# EAGLE design Laser_Teensy_No_AudShield_bckup (EAGLE 9.6.2)

## Sheet 1 of 3
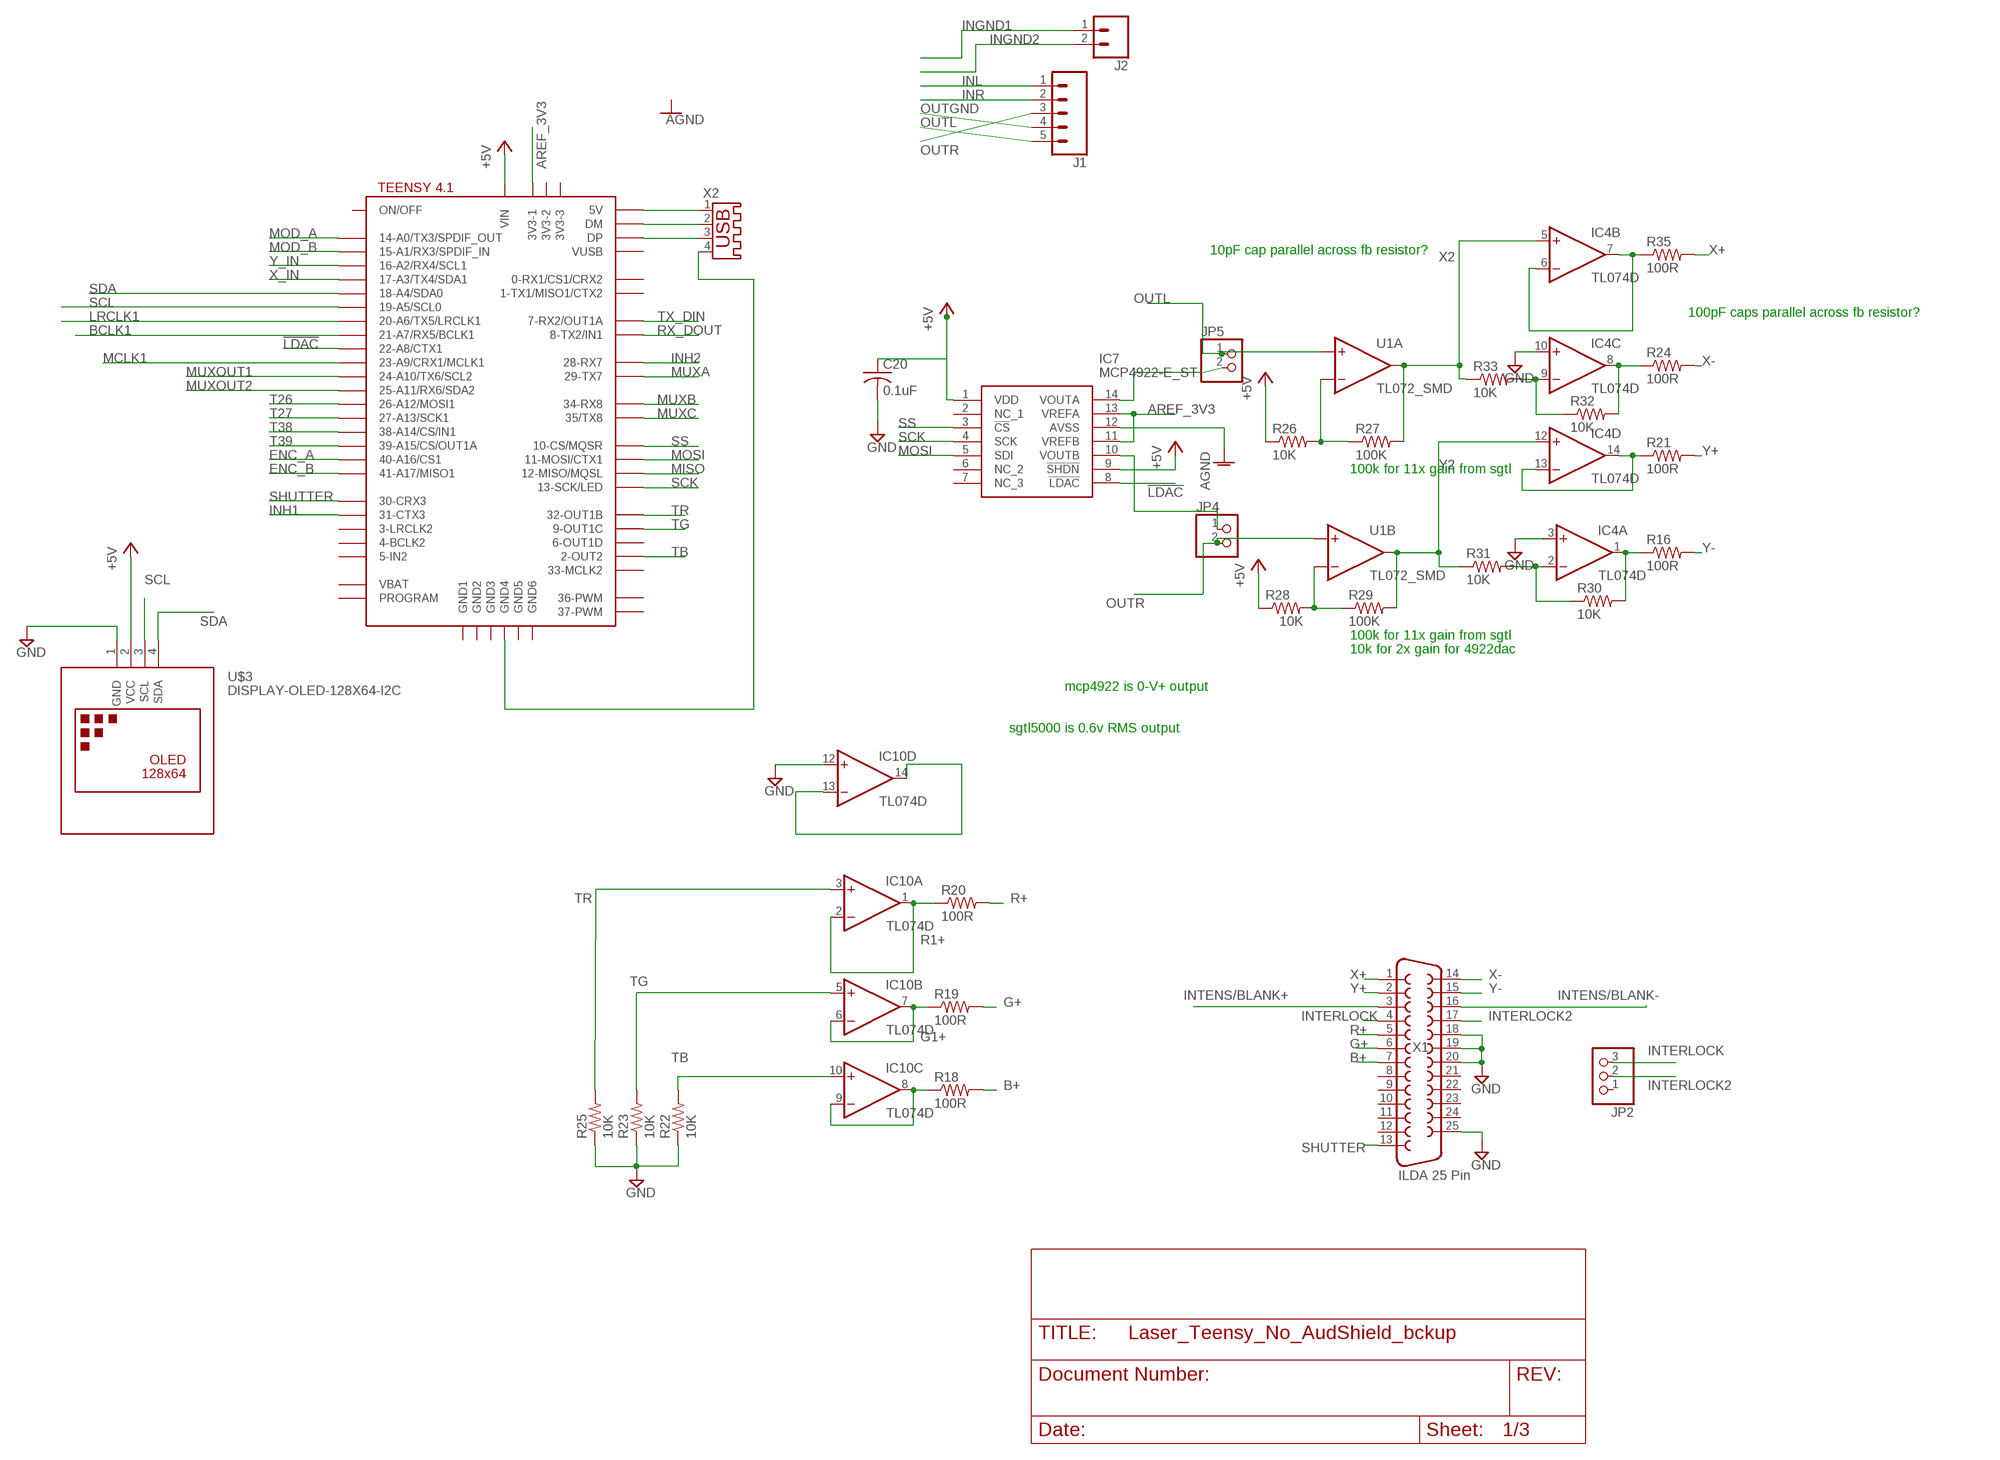
[diagram p0: schematic, sheet 1]

### Parts
C20  0.1uF  C-USC0603  [C0603]
IC4  TL074D  [SO14]
IC7  MCP4922-E_ST  [SOP65P638X110-14N]
IC10  TL074D  [SO14]
J1  CONN_05  [1X05]
J2  CONN_02  [1X02]
JP2  PINHD-1X3  [1X03]
JP4  PINHD-1X2  [1X02]
JP5  PINHD-1X2  [1X02]
R16  100R  R-US_0204/5  [0204/5]
R18  100R  R-US_0204/5  [0204/5]
R19  100R  R-US_0204/5  [0204/5]
R20  100R  R-US_0204/5  [0204/5]
R21  100R  R-US_0204/5  [0204/5]
R22  10K  R-US_0204/5  [0204/5]
R23  10K  R-US_0204/5  [0204/5]
R24  100R  R-US_0204/5  [0204/5]
R25  10K  R-US_0204/5  [0204/5]
R26  10K  R-US_0204/5  [0204/5]
R27  100K  R-US_0204/5  [0204/5]
R28  10K  R-US_0204/5  [0204/5]
R29  100K  R-US_0204/5  [0204/5]
R30  10K  R-US_0204/5  [0204/5]
R31  10K  R-US_0204/5  [0204/5]
R32  10K  R-US_R0603  [R0603]
R33  10K  R-US_0204/5  [0204/5]
R35  100R  R-US_0204/5  [0204/5]
U1  TL072_SMD  [SO08]
U$2  TEENSY41-E  [TENNSY41-E]
U$3  DISPLAY-OLED-128X64-I2C  [DISPLAY-OLED-128X64-I2C]
X1  ILDA 25 Pin  F25D  [F25D]
X2  USB-A003  [USB-A003]

### Nets
!LDAC: IC7.8(!LDAC) U$2.22-A8/CTX1
+5V [power]: C20.1 IC7.1(VDD) IC7.9(!SHDN) R26.1 R28.1 U$2.VIN U$3.2(VCC) ; also sheet 2,3
AGND: IC7.12(AVSS)
AREF_3V3: IC7.11(VREFB) IC7.13(VREFA) U$2.3V3-1
B1+1: IC10.8(C:OUT) IC10.9(C:-IN) R18.1
B+: R18.2 X1.7
BCLK1: U$2.21-A7/RX5/BCLK1
ENC_A: U$2.40-A16/CS1 ; also sheet 2
ENC_B: U$2.41-A17/MISO1 ; also sheet 2
G1+: IC10.6(B:-IN) IC10.7(B:OUT) R19.1
G+: R19.2 X1.6
GND: C20.2 IC4.3(A:+IN) IC4.10(C:+IN) IC10.12(D:+IN) R22.1 R23.1 R25.1 U$3.1(GND) X1.18 X1.19 X1.20 X1.25 ; also sheet 2,3
INGND1: J2.1
INGND2: J2.2
INH1: U$2.31-CTX3 ; also sheet 2
INH2: U$2.28-RX7 ; also sheet 2
INL: J1.1
INR: J1.2
INTENS/BLANK+: X1.3
INTENS/BLANK-: X1.16
INTERLOCK: JP2.3 X1.4
INTERLOCK2: JP2.2 X1.17
LRCLK1: U$2.20-A6/TX5/LRCLK1
MCLK1: U$2.23-A9/CRX1/MCLK1
MISO: U$2.12-MISO/MQSL
MOD_A: U$2.14-A0/TX3/SPDIF_OUT ; also sheet 2
MOD_B: U$2.15-A1/RX3/SPDIF_IN ; also sheet 2
MOSI: IC7.5(SDI) U$2.11-MOSI/CTX1
MUXA: U$2.29-TX7 ; also sheet 2
MUXB: U$2.34-RX8 ; also sheet 2
MUXC: U$2.35-TX8(35/TX8) ; also sheet 2
MUXOUT1: U$2.24-A10/TX6/SCL2 ; also sheet 2
MUXOUT2: U$2.25-A11/RX6/SDA2 ; also sheet 2
N$1: IC7.14(VOUTA) JP5.2
N$3: U$2.+5V(5V) X2.1
N$4: U$2.DM X2.2
N$5: U$2.DP X2.3
N$12: U$2.GND4 X2.4
N$13: IC10.13(D:-IN) IC10.14(D:OUT)
N$17: IC7.10(VOUTB) JP4.1
N$30: R26.2 R27.1 U1.2(A:-IN)
N$31: R28.2 R29.1 U1.6(B:-IN)
N$35: IC4.9(C:-IN) R32.1 R33.2
N$36: IC4.2(A:-IN) R30.1 R31.2
OUTGND: J1.4
OUTL: J1.5 JP5.1 U1.3(A:+IN)
OUTR: J1.3 JP4.2 U1.5(B:+IN)
R1+: IC10.1(A:OUT) IC10.2(A:-IN) R20.1
R+: R20.2 X1.5
RX_DOUT: U$2.8-TX2/IN1
SCK: IC7.4(SCK) U$2.13-SCK/LED
SCL: U$2.19-A5/SCL0 U$3.3(SCL)
SDA: U$2.18-A4/SDA0 U$3.4(SDA)
SHUTTER: U$2.30-CRX3 X1.13
SS: IC7.3(!CS) U$2.10-CS\MQSR(10-CS/MQSR)
T26: U$2.26-A12/MOSI1 ; also sheet 2
T27: U$2.27-A13/SCK1 ; also sheet 2
T38: U$2.38-A14/CS/IN1 ; also sheet 2
T39: U$2.39-A15/CS/OUT1A
TB: IC10.10(C:+IN) R22.2 U$2.2-OUT2
TG: IC10.5(B:+IN) R23.2 U$2.9-OUT1C
TR: IC10.3(A:+IN) R25.2 U$2.32-OUT1B
TX_DIN: U$2.7-RX2/OUT1A
X1+: IC4.6(B:-IN) IC4.7(B:OUT) R35.1
X1-: IC4.8(C:OUT) R24.1 R32.2
X2: IC4.5(B:+IN) R27.2 R33.1 U1.1(A:OUT)
X+: R35.2 X1.1
X-: R24.2 X1.14
X_IN: U$2.17-A3/TX4/SDA1 ; also sheet 2
Y1+: IC4.13(D:-IN) IC4.14(D:OUT) R21.1
Y1-: IC4.1(A:OUT) R16.1 R30.2
Y2: IC4.12(D:+IN) R29.2 R31.1 U1.7(B:OUT)
Y+: R21.2 X1.2
Y-: R16.2 X1.15
Y_IN: U$2.16-A2/RX4/SCL1 ; also sheet 2
Unconnected: IC7.2(NC_1) IC7.6(NC_2) IC7.7(NC_3) JP2.1 U$2.0-RX1/CS1/CRX2 U$2.1-TX1/MISO1/CTX2 U$2.3-LRCLK2 U$2.3V3-2 U$2.3V3-3 U$2.4-BCLK2 U$2.5-IN2 U$2.6-OUT1D U$2.33-MCLK2 U$2.36-PWM U$2.37-PWM U$2.GND1 U$2.GND2 U$2.GND3 U$2.GND5 U$2.GND6 U$2.ON/OFF U$2.PROGRAM U$2.VBAT U$2.VUSB X1.8 X1.9 X1.10 X1.11 X1.12 X1.21 X1.22 X1.23 X1.24

### Notes on the sheet
- 10pF cap parallel across fb resistor?
- 100pF caps parallel across fb resistor?
- 100k for 11x gain from sgtl
- 100k for 11x gain from sgtl
- 10k for 2x gain for 4922dac
- mcp4922 is 0-V+ output
- sgtl5000 is 0.6v RMS output

## Sheet 2 of 3
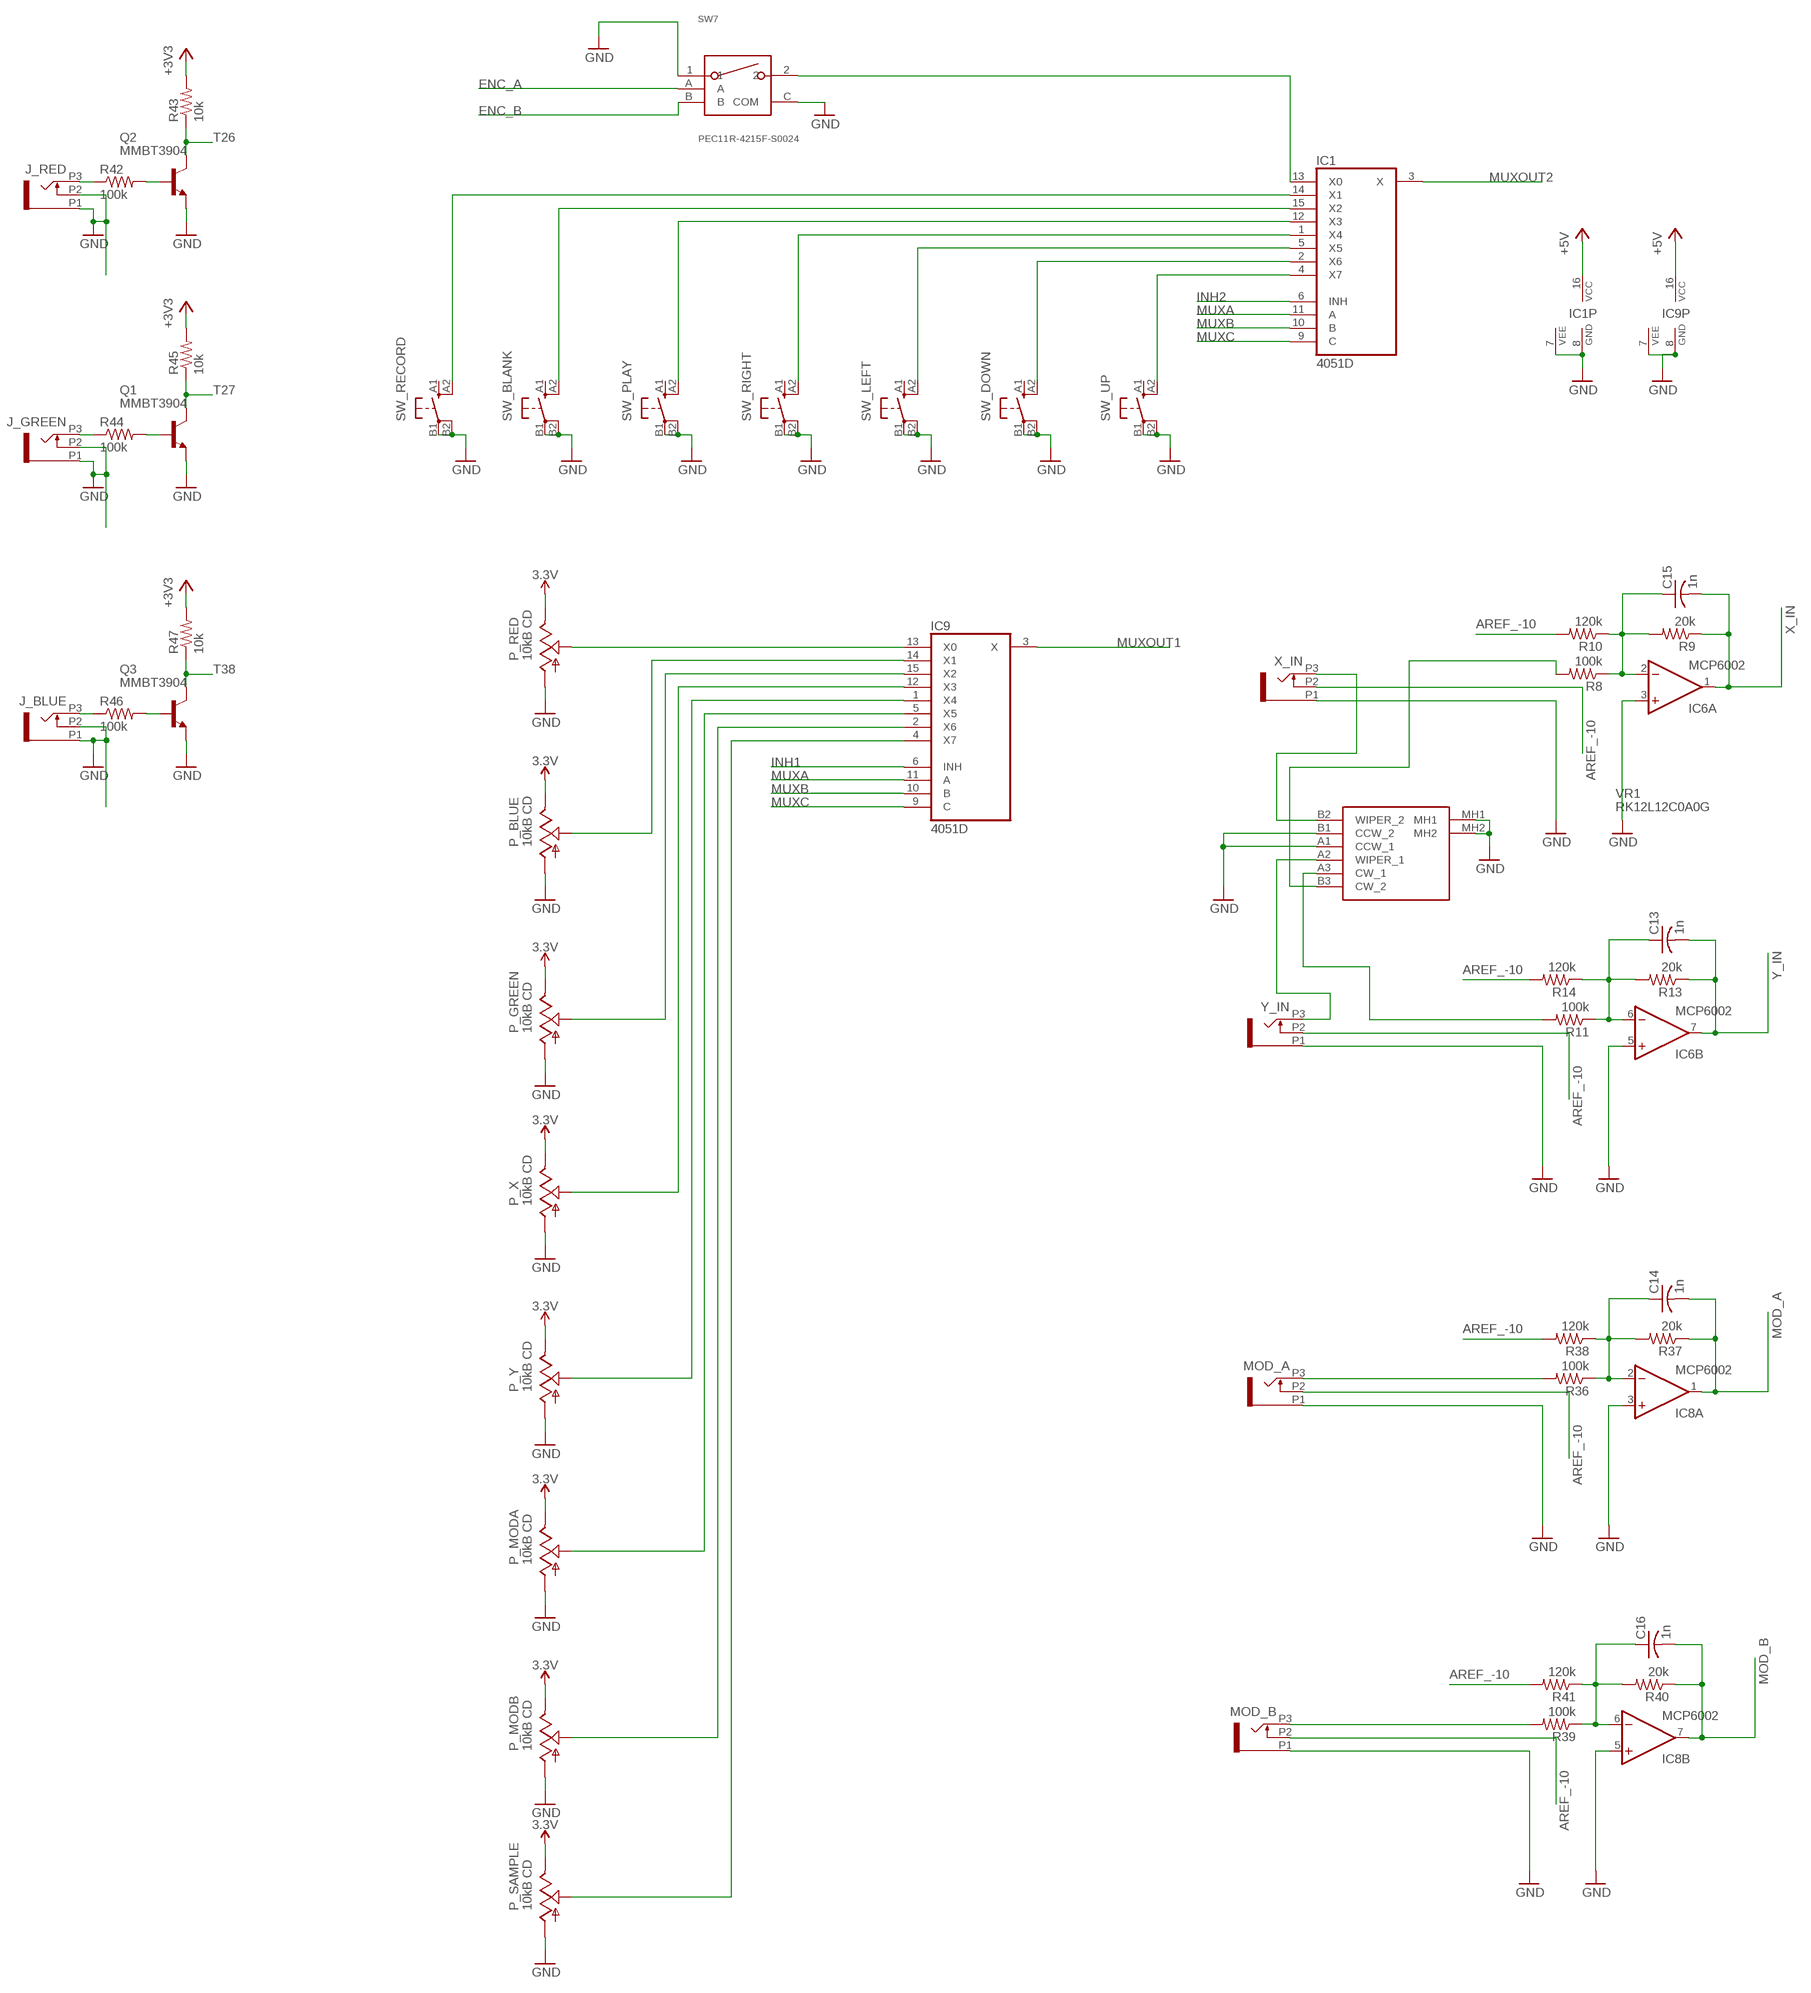
[diagram p1: schematic, sheet 2]

### Parts
C13  1n  C-US050-025X075  [C050-025X075]
C14  1n  C-US050-025X075  [C050-025X075]
C15  1n  C-US050-025X075  [C050-025X075]
C16  1n  C-US050-025X075  [C050-025X075]
IC1  4051D  [SO16]
IC6  MCP6002  TL072D  [SO08]
IC8  MCP6002  TL072D  [SO08]
IC9  4051D  [SO16]
J_BLUE  PJ301_THONKICONN6  [WQP_PJ_301M6]
J_GREEN  PJ301_THONKICONN6  [WQP_PJ_301M6]
J_RED  PJ301_THONKICONN6  [WQP_PJ_301M6]
MOD_A  PJ301_THONKICONN6  [WQP_PJ_301M6]
MOD_B  PJ301_THONKICONN6  [WQP_PJ_301M6]
P_BLUE  10kB CD  POT_USVERTICAL_PS  [ALPS_POT_VERTICAL_PS]
P_GREEN  10kB CD  POT_USVERTICAL_PS  [ALPS_POT_VERTICAL_PS]
P_MODA  10kB CD  POT_USVERTICAL_PS  [ALPS_POT_VERTICAL_PS]
P_MODB  10kB CD  POT_USVERTICAL_PS  [ALPS_POT_VERTICAL_PS]
P_RED  10kB CD  POT_USVERTICAL_PS  [ALPS_POT_VERTICAL_PS]
P_SAMPLE  10kB CD  POT_USVERTICAL_PS  [ALPS_POT_VERTICAL_PS]
P_X  10kB CD  POT_USVERTICAL_PS  [ALPS_POT_VERTICAL_PS]
P_Y  10kB CD  POT_USVERTICAL_PS  [ALPS_POT_VERTICAL_PS]
Q1  MMBT3904  MMBT3904LT1-NPN-SOT23-BEC  [SOT23-BEC]
Q2  MMBT3904  MMBT3904LT1-NPN-SOT23-BEC  [SOT23-BEC]
Q3  MMBT3904  MMBT3904LT1-NPN-SOT23-BEC  [SOT23-BEC]
R8  100k  R-US_0204/5  [0204/5]
R9  20k  R-US_0204/5  [0204/5]
R10  120k  R-US_0204/5  [0204/5]
R11  100k  R-US_0204/5  [0204/5]
R13  20k  R-US_0204/5  [0204/5]
R14  120k  R-US_0204/5  [0204/5]
R36  100k  R-US_0204/5  [0204/5]
R37  20k  R-US_0204/5  [0204/5]
R38  120k  R-US_0204/5  [0204/5]
R39  100k  R-US_0204/5  [0204/5]
R40  20k  R-US_0204/5  [0204/5]
R41  120k  R-US_0204/5  [0204/5]
R42  100k  R-US_0204/5  [0204/5]
R43  10k  R-US_0204/5  [0204/5]
R44  100k  R-US_0204/5  [0204/5]
R45  10k  R-US_0204/5  [0204/5]
R46  100k  R-US_0204/5  [0204/5]
R47  10k  R-US_0204/5  [0204/5]
SW7  PEC11R-4215F-S0024  [PEC11R-4215F-S0024]
SW_BLANK  D6R  [D6R]
SW_DOWN  D6R  [D6R]
SW_LEFT  D6R  [D6R]
SW_PLAY  D6R  [D6R]
SW_RECORD  D6R  [D6R]
SW_RIGHT  D6R  [D6R]
SW_UP  D6R  [D6R]
VR1  RK12L12C0A0G  [RK12L12C0A0G]
X_IN  PJ301_THONKICONN6  [WQP_PJ_301M6]
Y_IN  PJ301_THONKICONN6  [WQP_PJ_301M6]

### Nets
3.3V [+3V3]: P_BLUE.P$1(E) P_GREEN.P$1(E) P_MODA.P$1(E) P_MODB.P$1(E) P_RED.P$1(E) P_SAMPLE.P$1(E) P_X.P$1(E) P_Y.P$1(E)
+3V3: R43.2 R45.2 R47.2 ; also sheet 3
+5V [power]: IC1.16(VCC) IC9.16(VCC) ; also sheet 1,3
AREF_-10 [-10V]: MOD_A.P2 MOD_B.P2 R10.2 R14.2 R38.2 R41.2 X_IN.P2 Y_IN.P2 ; also sheet 3
ENC_A: SW7.A ; also sheet 1
ENC_B: SW7.B ; also sheet 1
GND: IC1.7(VEE) IC1.8(GND) IC6.3(A:+IN) IC6.5(B:+IN) IC8.3(A:+IN) IC8.5(B:+IN) IC9.7(VEE) IC9.8(GND) J_BLUE.P1 J_BLUE.P2 J_GREEN.P1 J_GREEN.P2 J_RED.P1 J_RED.P2 MOD_A.P1 MOD_B.P1 P_BLUE.P$3(A) P_GREEN.P$3(A) P_MODA.P$3(A) P_MODB.P$3(A) P_RED.P$3(A) P_SAMPLE.P$3(A) P_X.P$3(A) P_Y.P$3(A) Q1.E Q2.E Q3.E SW7.1 SW7.C(COM) SW_BLANK.B1(P) SW_BLANK.B2(P1) SW_DOWN.B1(P) SW_DOWN.B2(P1) SW_LEFT.B1(P) SW_LEFT.B2(P1) SW_PLAY.B1(P) SW_PLAY.B2(P1) SW_RECORD.B1(P) SW_RECORD.B2(P1) SW_RIGHT.B1(P) SW_RIGHT.B2(P1) SW_UP.B1(P) SW_UP.B2(P1) VR1.A1(CCW_1) VR1.B1(CCW_2) VR1.MH1 VR1.MH2 X_IN.P1 Y_IN.P1 ; also sheet 1,3
INH1: IC9.6(INH) ; also sheet 1
INH2: IC1.6(INH) ; also sheet 1
MOD_A: C14.2 IC8.1(A:OUT) R37.1 ; also sheet 1
MOD_B: C16.2 IC8.7(B:OUT) R40.1 ; also sheet 1
MUXA: IC1.11(A) IC9.11(A) ; also sheet 1
MUXB: IC1.10(B) IC9.10(B) ; also sheet 1
MUXC: IC1.9(C) IC9.9(C) ; also sheet 1
MUXOUT1: IC9.3(X) ; also sheet 1
MUXOUT2: IC1.3(X) ; also sheet 1
N$6: C15.1 IC6.2(A:-IN) R8.1 R9.2 R10.1
N$9: VR1.B2(WIPER_2) X_IN.P3
N$11: C13.1 IC6.6(B:-IN) R11.1 R13.2 R14.1
N$14: C14.1 IC8.2(A:-IN) R36.1 R37.2 R38.1
N$15: R8.2 VR1.B3(CW_2)
N$19: IC1.14(X1) SW_RECORD.A2(S1)
N$20: IC1.15(X2) SW_BLANK.A2(S1)
N$21: IC1.12(X3) SW_PLAY.A2(S1)
N$22: IC9.13(X0) P_RED.P$2(S)
N$23: IC1.1(X4) SW_RIGHT.A2(S1)
N$24: IC9.14(X1) P_BLUE.P$2(S)
N$25: VR1.A2(WIPER_1) Y_IN.P3
N$26: IC1.5(X5) SW_LEFT.A2(S1)
N$27: IC9.15(X2) P_GREEN.P$2(S)
N$28: IC1.2(X6) SW_DOWN.A2(S1)
N$29: IC9.12(X3) P_X.P$2(S)
N$32: IC9.1(X4) P_Y.P$2(S)
N$33: IC1.4(X7) SW_UP.A2(S1)
N$34: C16.1 IC8.6(B:-IN) R39.1 R40.2 R41.1
N$39: IC1.13(X0) SW7.2
N$40: IC9.5(X5) P_MODA.P$2(S)
N$41: IC9.2(X6) P_MODB.P$2(S)
N$42: IC9.4(X7) P_SAMPLE.P$2(S)
N$43: R11.2 VR1.A3(CW_1)
N$44: J_RED.P3 R42.1
N$45: MOD_A.P3 R36.2
N$46: MOD_B.P3 R39.2
N$48: Q1.B R44.2
N$49: J_GREEN.P3 R44.1
N$51: Q3.B R46.2
N$52: J_BLUE.P3 R46.1
N$66: Q2.B R42.2
T26: Q2.C R43.1 ; also sheet 1
T27: Q1.C R45.1 ; also sheet 1
T38: Q3.C R47.1 ; also sheet 1
X_IN: C15.2 IC6.1(A:OUT) R9.1 ; also sheet 1
Y_IN: C13.2 IC6.7(B:OUT) R13.1 ; also sheet 1
Unconnected: SW_BLANK.A1(S) SW_DOWN.A1(S) SW_LEFT.A1(S) SW_PLAY.A1(S) SW_RECORD.A1(S) SW_RIGHT.A1(S) SW_UP.A1(S)

## Sheet 3 of 3
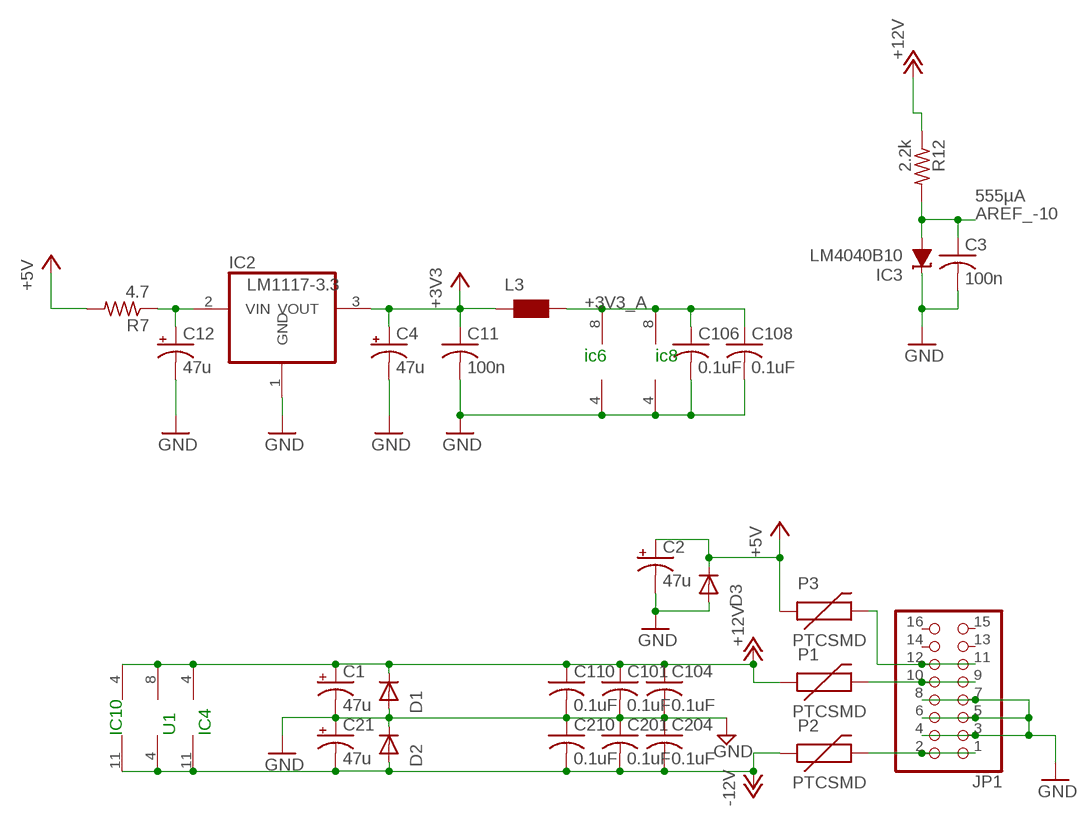
[diagram p2: schematic, sheet 3]

### Parts
C1  47u  CPOL-USE3.5-8  [E3,5-8]
C2  47u  CPOL-USE3.5-8  [E3,5-8]
C3  100n  C-USC0603  [C0603]
C4  47u  CPOL-USE3.5-8  [E3,5-8]
C11  100n  C-USC0603  [C0603]
C12  47u  CPOL-USE3.5-8  [E3,5-8]
C21  47u  CPOL-USE3.5-8  [E3,5-8]
C101  0.1uF  C-USC0603  [C0603]
C104  0.1uF  C-USC0603  [C0603]
C106  0.1uF  C-USC0603  [C0603]
C108  0.1uF  C-USC0603  [C0603]
C110  0.1uF  C-USC0603  [C0603]
C201  0.1uF  C-USC0603  [C0603]
C204  0.1uF  C-USC0603  [C0603]
C210  0.1uF  C-USC0603  [C0603]
D1  1N5819HW  DIODE-SOD123  [SOD123]
D2  1N5819HW  DIODE-SOD123  [SOD123]
D3  1N5819HW  DIODE-SOD123  [SOD123]
IC2  LM1117-3.3  REG1117T  [TO252]
IC3  LM4040B10  LM4041B12DBZ  [DBZ_R-PDSO-G3]
JP1  PINHD-2X8  [2X08]
L3  WE-CBF_0603  [0603]
P1  PTCSMD  [PTC-1206]
P2  PTCSMD  [PTC-1206]
P3  PTCSMD  [PTC-1206]
R7  4.7  R-US_R1206  [R1206]
R12  2.2k  R-US_0204/5  [0204/5]

### Nets
+3V3: C4.+ C11.1 IC2.3(VOUT) L3.1 ; also sheet 2
+3V3_A: C106.1 C108.1 IC6.8(P:V+) IC8.8(P:V+) L3.2
+5V [power]: C2.+ D3.C P3.1 R7.2 ; also sheet 1,2
+12V [power]: C1.+ C101.1 C104.1 C110.1 D1.C IC4.4(P:V+) IC10.4(P:V+) P1.1 R12.1 U1.8(P:V+)
-12V [power]: C21.- C201.2 C204.2 C210.2 D2.A IC4.11(P:V-) IC10.11(P:V-) P2.1 U1.4(P:V-)
AREF_-10 [-10V]: C3.1 IC3.2(A) R12.2 ; also sheet 2
GND: C1.- C2.- C3.2 C4.- C11.2 C12.- C21.+ C101.2 C104.2 C106.2 C108.2 C110.2 C201.1 C204.1 C210.1 D1.A D2.C D3.A IC2.1(GND) IC3.1(C) IC6.4(P:V-) IC8.4(P:V-) JP1.3 JP1.4 JP1.5 JP1.6 JP1.7 JP1.8 ; also sheet 1,2
N$7: JP1.1 JP1.2 P2.2
N$8: JP1.9 JP1.10 P1.2
N$10: JP1.11 JP1.12 P3.2
N$16: C12.+ IC2.2(VIN) R7.1
Unconnected: JP1.13 JP1.14 JP1.15 JP1.16

### Notes on the sheet
- 555µA
- ic6 | ic8
- IC10 | U1 | IC4

## Library data of the parts
C1 C2 C4 C12 C21 = rcl:CPOL-US: POLARIZED CAPACITOR, American symbol; SPICEPREFIX: C
C3 C11 = rcl:C-US: CAPACITOR, American symbol
C13-C16 = rcl:C-US: CAPACITOR, American symbol; SPICEPREFIX: C
C20 C101 C104 C106 C108 C110 C201 C204 C210 = adafruit:C-US: CAPACITOR, American symbol
D1-D3 = diode:DIODE-: DIODE
IC1 IC9 = 40xx:4051: 8-channel ANALOG MULTIPLEXER
IC2 = og-vreg:REG1117: 800mA and 1A Low Dropout (LDO) Positive Regulator 1.8V, 2.5V, 2.85V, 3.3V, 5V, and Adj
IC3 = texas:LM4041: PRECISION MICROPOWER SHUNT VOLTAGE REFERENCE Source: http://focus.ti.com/lit/ds/slcs146e/slcs146e.pdf
IC4 IC10 = linear:TL074: OP AMP
IC6 IC8 = linear:TL072: OP AMP
IC7 = SamacSys_Parts:MCP4922-E_ST: Microchip MCP4922-E/ST, 2-channel 12 bit Serial DAC, 14-Pin TSSOP Source: Datasheet <http://componentsearchengine.com/Datasheets/3/MCP4922-E_ST.pdf>; ARROW_PART_NUMBER: MCP4922-E/ST; ARROW_PRICE-STOCK: https://www.arrow.com/en/products/mcp4922-est/microchip-technology; DESCRIPTION: Microchip MCP4922-E/ST, 2-channel 12 bit Serial DAC, 14-Pin TSSOP; HEIGHT: 1.1mm; MANUFACTURER_NAME: Microchip; MANUFACTURER_PART_NUMBER: MCP4922-E/ST; MOUSER_PART_NUMBER: 579-MCP4922-E/ST; MOUSER_PRICE-STOCK: https://www.mouser.co.uk/ProductDetail/Microchip-Technology/MCP4922-E-ST?qs=iRhCjdSJZe6gRerFwLixKQ%3D%3D
J1 = SparkFun-Connectors:CONN_05: Multi connection point. Often used as Generic Header-pin footprint for 0.1 inch spaced/style header connections On any of the 0.1 inch spaced packages, you can populate with these: Break Away Headers - Straight <https://www.sparkfun.com/products/116> (PRT-00116) Break Away Male Headers - Right Angle <https://www.sparkfun.com/products/553> (PRT-00553) Female Headers <https://www.sparkfun.com/products/115> (PRT-00115) Break Away Headers - Machine Pin <https://www.sparkfun.com/products/117> (PRT-00117) Break Away Female Headers - Swiss Machine Pin <https://www.sparkfun.com/products/743> (PRT-00743) For SCREWTERMINALS and SPRING TERMINALS visit here: Screw Terimnals on SparkFun.com <https://www.sparkfun.com/search/results?term=Screw+Terminals> (5mm/3.5mm/2.54mm spacing) This device is also useful as a general connection point to wire up your design to another part of your project. Our various solder wires solder well into these plated through hole pads. Hook-Up Wire - Assortment (Stranded, 22 AWG) <https://www.sparkfun.com/products/11375> (PRT-11375) Hook-Up Wire - Assortment (Solid Core, 22 AWG) <https://www.sparkfun.com/products/11367> (PRT-11367) View the entire wire category on our website here <https://www.sparkfun.com/categories/141> Special notes: Molex polarized connector foot print use with SKU : PRT-08231 with associated crimp pins and housings. 1MM SMD Version SKU: PRT-10208
J2 = SparkFun-Connectors:CONN_02: Multi connection point. Often used as Generic Header-pin footprint for 0.1 inch spaced/style header connections On any of the 0.1 inch spaced packages, you can populate with these: Break Away Headers - Straight <https://www.sparkfun.com/products/116> (PRT-00116) Break Away Male Headers - Right Angle <https://www.sparkfun.com/products/553> (PRT-00553) Female Headers <https://www.sparkfun.com/products/115> (PRT-00115) Break Away Headers - Machine Pin <https://www.sparkfun.com/products/117> (PRT-00117) Break Away Female Headers - Swiss Machine Pin <https://www.sparkfun.com/products/743> (PRT-00743) For SCREWTERMINALS and SPRING TERMINALS visit here: Screw Terimnals on SparkFun.com <https://www.sparkfun.com/search/results?term=Screw+Terminals> (5mm/3.5mm/2.54mm spacing) This device is also useful as a general connection point to wire up your design to another part of your project. Our various solder wires solder well into these plated through hole pads. Hook-Up Wire - Assortment (Stranded, 22 AWG) <https://www.sparkfun.com/products/11375> (PRT-11375) Hook-Up Wire - Assortment (Solid Core, 22 AWG) <https://www.sparkfun.com/products/11367> (PRT-11367) View the entire wire category on our website here <https://www.sparkfun.com/categories/141> Special notes: Molex polarized connector foot print use with: PRT-08233 with associated crimp pins and housings. 2.54_SCREWTERM for use with PRT-10571. 3.5mm Screw Terminal footprints for PRT-08084 5mm Screw Terminal footprints for use with PRT-08432
J_BLUE J_GREEN J_RED = og-pj301:PJ301_THONKICONN
JP1 = pinhead:PINHD-2X8: PIN HEADER
JP2 = pinhead:PINHD-1X3: PIN HEADER
JP4 JP5 = pinhead:PINHD-1X2: PIN HEADER
L3 = wuerth-elektronik:WE-CBF: SMD EMI Suppression Ferrite Beads - excellent anti-EMI properties - low DCR - impedances till 3000 ohms - rated current up to 6 A
MOD_A MOD_B X_IN Y_IN = og-pj301_variations:PJ301_THONKICONN
P1-P3 = SparkFun:PTC: Resettable Fuse PTC Resettable Fuse. Spark Fun Electronics SKU : COM-08357
P_BLUE P_GREEN P_MODA P_MODB P_RED P_SAMPLE P_X P_Y = pot-alps:POT_US
Q1-Q3 = transistor:*-NPN-: NPN Transistror BF959 corrected 2008.03.06
R7 = rcl:R-US_: RESISTOR, American symbol
R8-R14 R16 R18-R31 R33 R35-R47 = rcl:R-US_: RESISTOR, American symbol; SPICEPREFIX: R
R32 = resistor:R-US_: RESISTOR, American symbol
SW7 = Switch:PEC11R-4215F-S0024: ROTARY ENCODER MECHANICAL 24PPR Manufacturer's datasheet <https://www.bourns.com/docs/Product-Datasheets/PEC11R.pdf>; CREATED_BY: PCBLayout.com; DIGIKEY_PART_NUMBER: PEC11R-4215F-S0024-ND; MANUFACTURER: Bourns Inc.; MPN: PEC11R-4215F-S0024
SW_BLANK SW_DOWN SW_LEFT SW_PLAY SW_RECORD SW_RIGHT SW_UP = og-switch:D6R: C&K D6R
U1 = MusicThingModular:TL072: Generic Dual Op Amp
U$2 = teensy:TEENSY41-E
U$3 = diy-modules:DISPLAY-OLED-128X64-I2C: 128x64 Dot Matrix OLED Module based on SSD1306 chip Variant with I2C interface More details available here: http://www.instructables.com/id/Monochrome-096-i2c-OLED-display-with-arduino-SSD13/ SSD1306 datasheet: https://cdn-shop.adafruit.com/datasheets/SSD1306.pdf Click here to find device on ebay.com <http://www.ebay.com/sch/oled+display+128x64+iic> Note: There are two variants: I2C and SPI. Search for the proper version.
VR1 = SamacSys_Parts:RK12L12C0A0G: Alps Potentiometer RK12L Series with a 6 mm Dia. Shaft 10k +/-20%, Logarithmic, Through Hole Source: Datasheet <http://uk.rs-online.com/web/p/products/7293697P>; DESCRIPTION: Alps Potentiometer RK12L Series with a 6 mm Dia. Shaft 10k +/-20%, Logarithmic, Through Hole; HEIGHT: 15mm; MANUFACTURER_NAME: ALPS; MANUFACTURER_PART_NUMBER: RK12L12C0A0G; MOUSER_PART_NUMBER: 688-RK12L12C0A0G; MOUSER_PRICE-STOCK: https://www.mouser.co.uk/ProductDetail/ALPS/RK12L12C0A0G?qs=haWY0xvQGj%2FMhz6JhOHy%252BQ%3D%3D
X1 = SparkFun:F25: D-SUB 25 25 Pin male connector. PCB edge mount for regular PCB thicknesses. This connector will connect directly to the back of a PC parallel port or through a normal DB25 extension cable (M/F). SKU: PRT-08287
X2 = con-yamaichi:USB-A003: USB connector; OC_FARNELL: unknown; OC_NEWARK: unknown

## Net classes
1 power: width 0.305 mm, clearance 0.203 mm
2 +3V3: width 0.356 mm, clearance 0.152 mm to class 0, clearance 0.254 mm
3 -10V: width 0.356 mm, clearance 0.152 mm to class 0, clearance 0.254 mm
4 VCC: width 0.457 mm, clearance 0.152 mm to class 0, clearance 0.254 mm

## Board
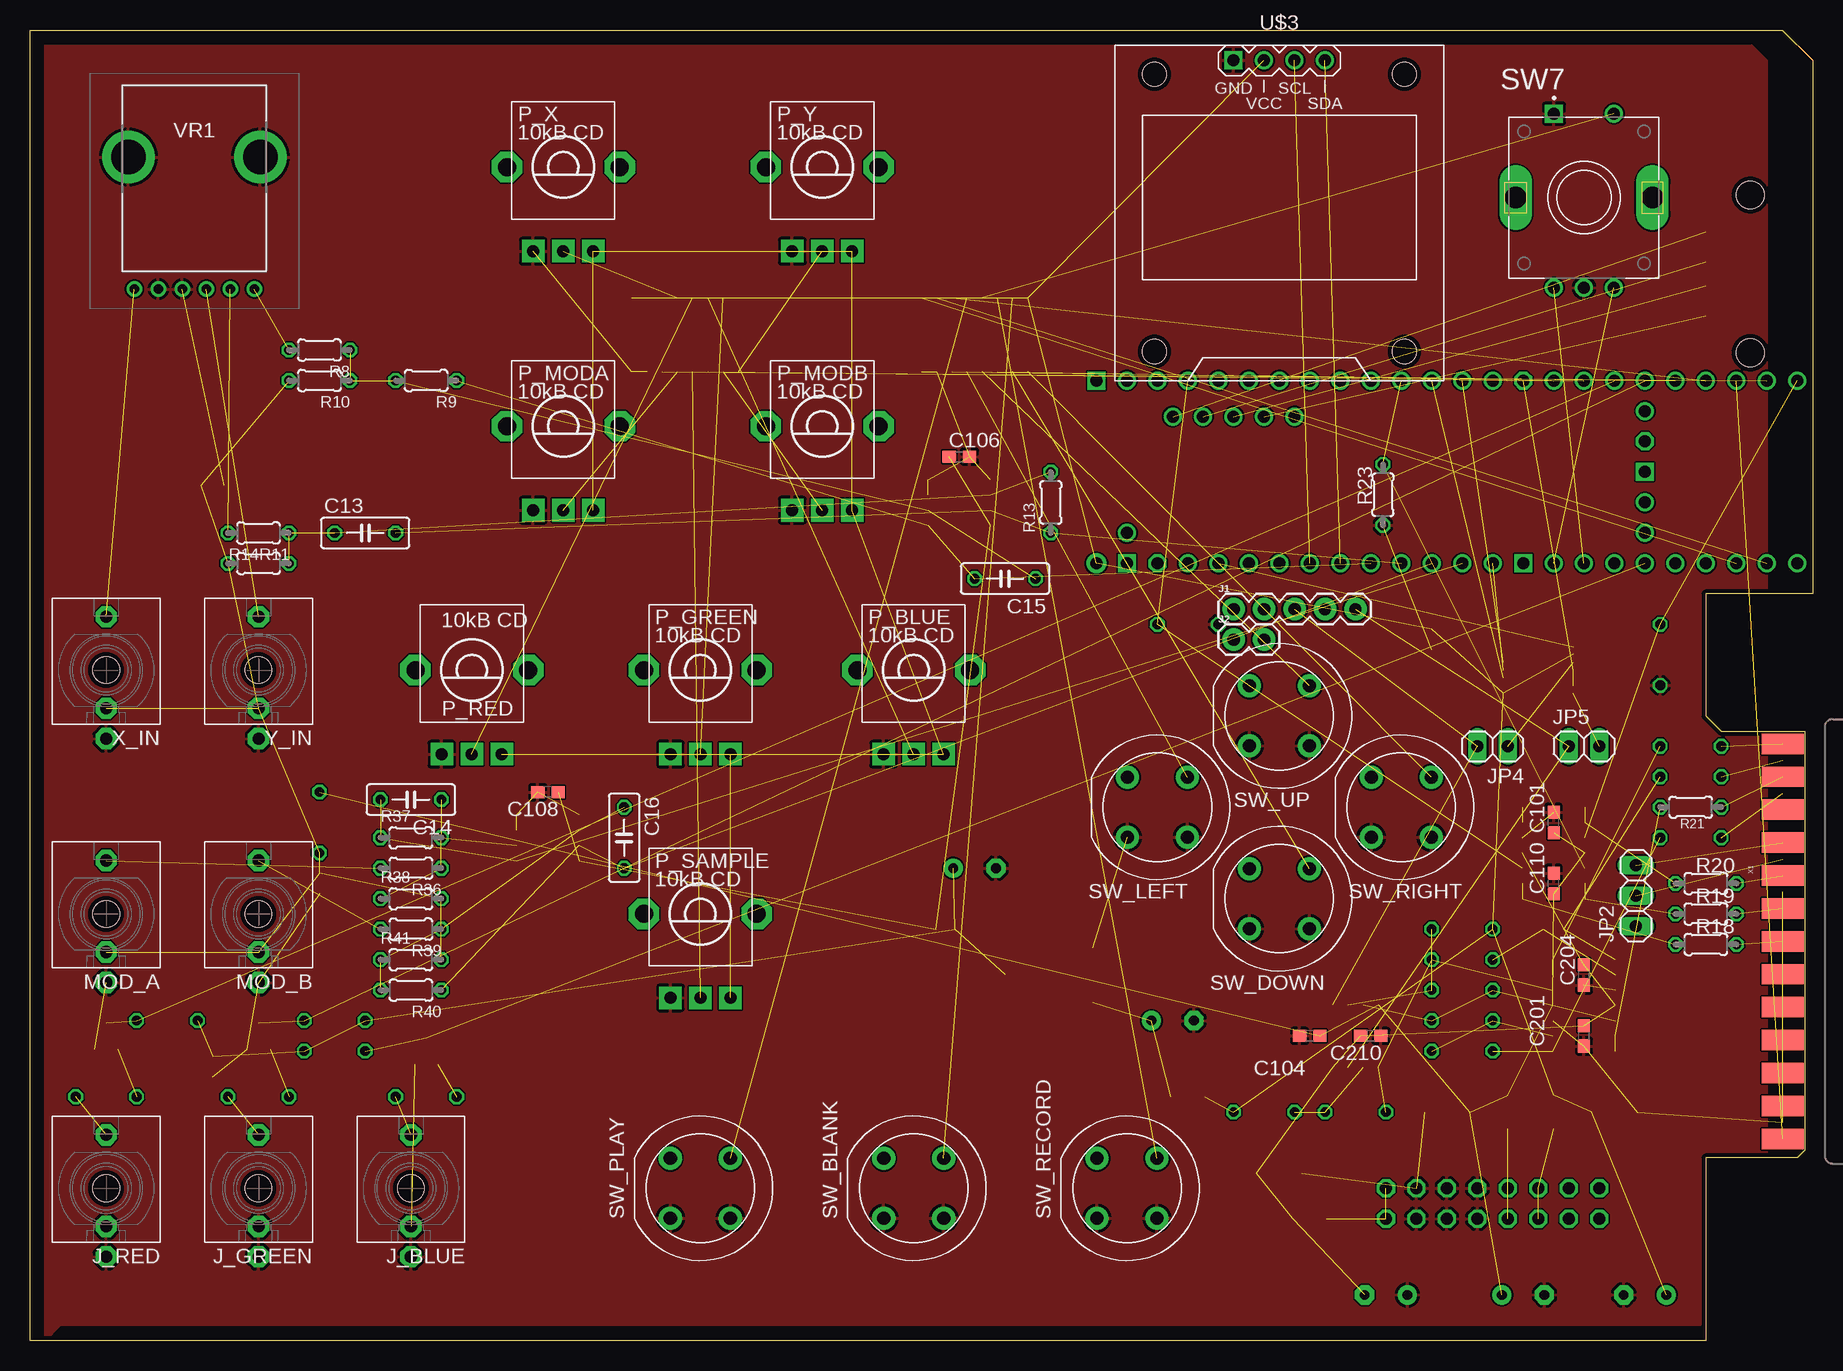
[diagram p3: board, top side]
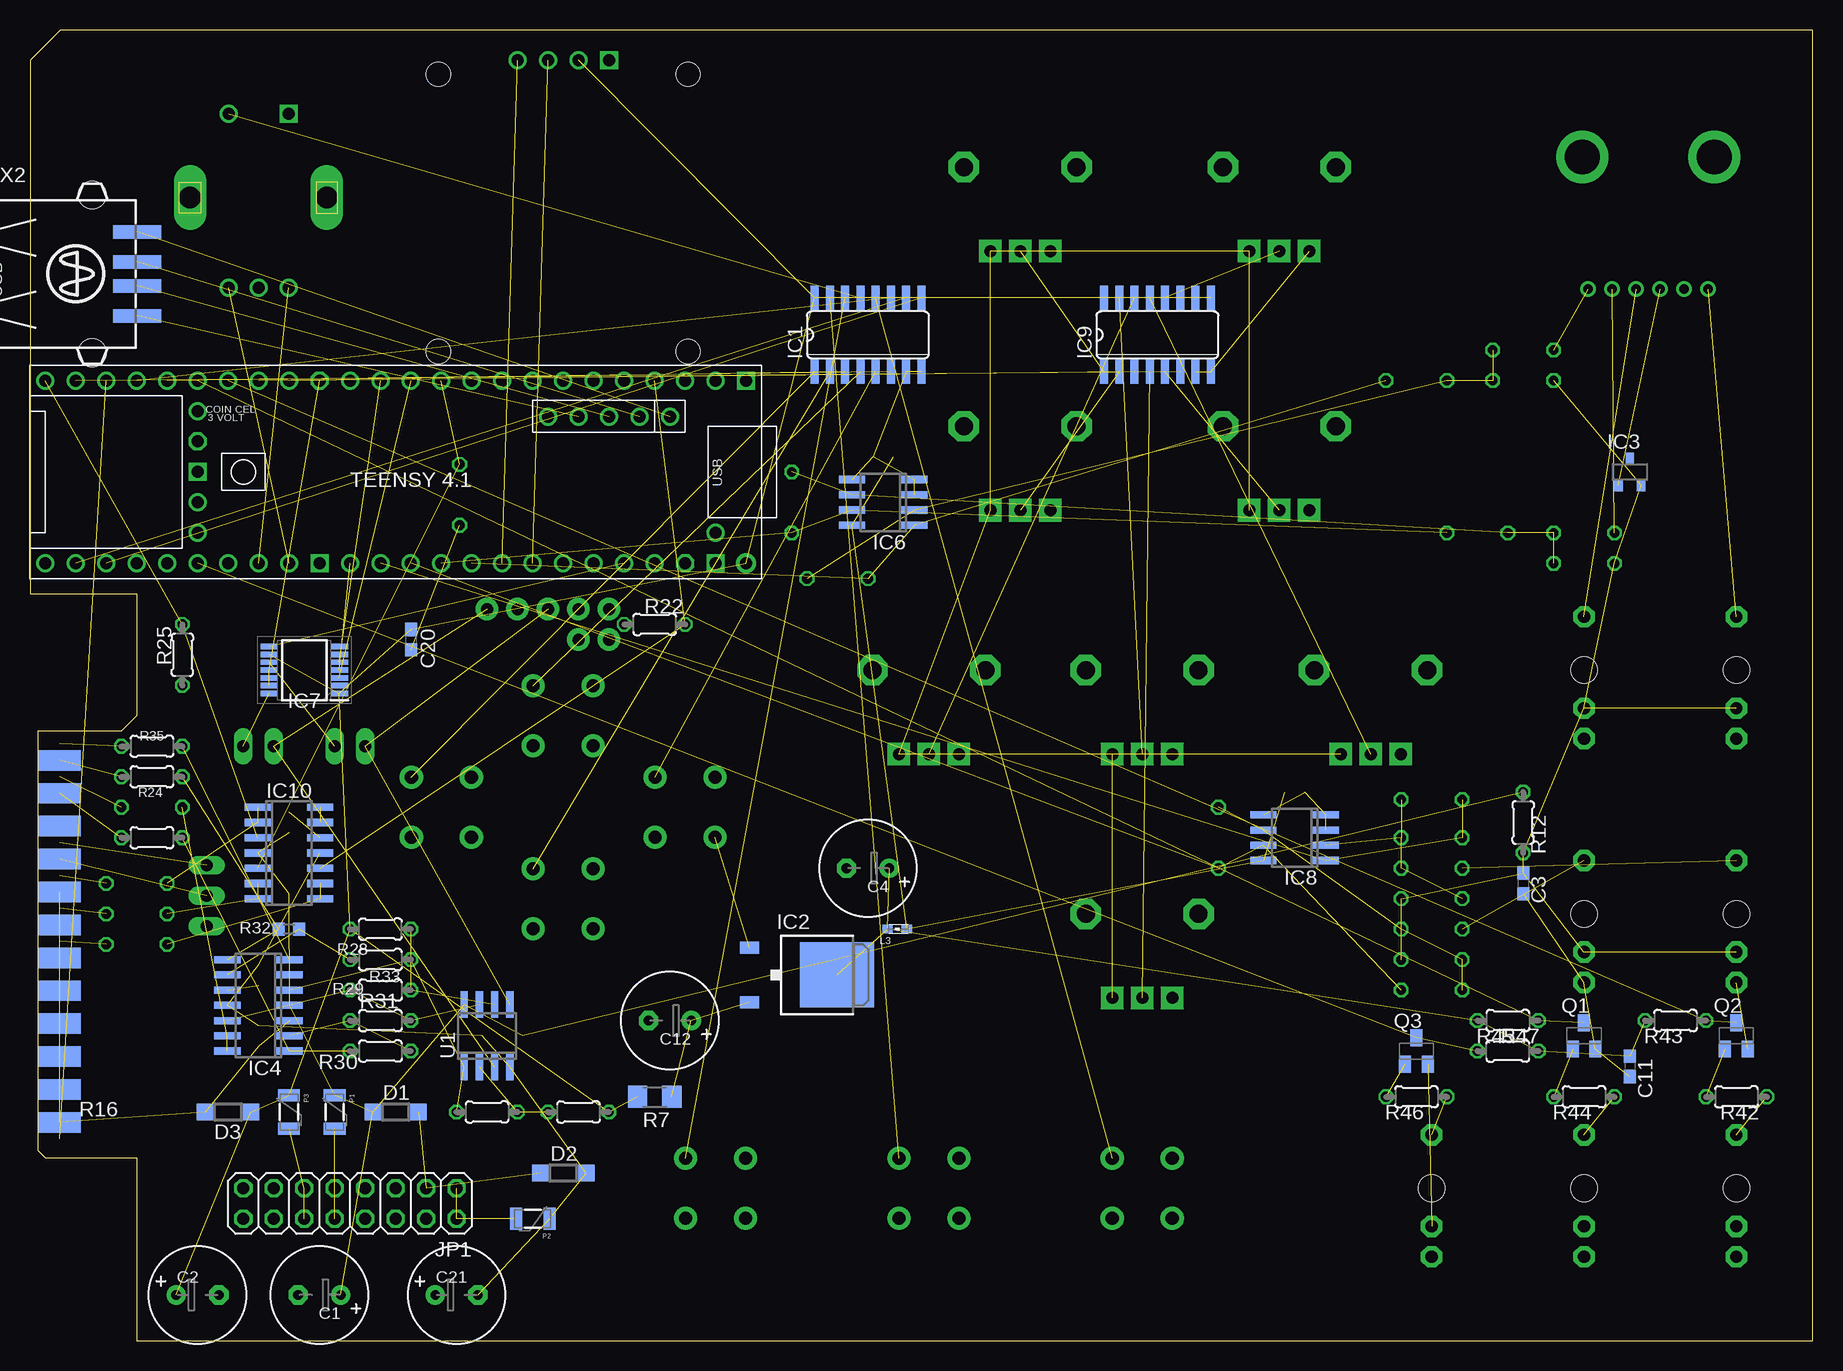
[diagram p4: board, bottom side, seen from below]

Size 148.59 x 109.22 mm. Coordinates in mm from the lower left corner, seen from the top.
Outline: 0,0 0,109.22 146.05,109.22 148.59,106.68 148.59,62.23 139.7,62.23 139.7,52.07 140.97,50.8 147.95,50.8 147.95,15.88 147.32,15.24 139.7,15.24 139.7,0 0,0
Copper layers (1*16): Top 0.0356mm / dielectric 1.5011mm / Bottom 0.0356mm
Design rules "LaenPCBOrder": minimum track width 6mil, minimum drill 13mil, track to track 6mil, track to pad 6mil, pad to pad 6mil, via to via 6mil, smd to smd 6mil, copper to edge 15mil, drill to drill 6mil, minimum pad ring 7mil, minimum via ring 7mil, stop-mask expansion 4mil, vias tented up to drill 0mil, thermal gap 10mil

### Footprints (pad centres in the part's own frame; a part is rotated, then mirrored left to right if it is on the bottom)
E3,5-8 = drill 0.813 pad 1.6: + -1.778,0 | drill 0.813 pad 1.6 octagon: - 1.778,0
C0603 = smd 1.1 x 1: 1 -0.85,0; 2 0.85,0
C050-025X075 = drill 0.813 octagon: 1 -2.54,0; 2 2.54,0
SOD123 = smd 1.4 x 1.4: A 1.9,0; C -1.9,0
SO16 = smd 0.66 x 2.032: 1 -4.445,-3.073; 2 -3.175,-3.073; 3 -1.905,-3.073; 4 -0.635,-3.073; 5 0.635,-3.073; 6 1.905,-3.073; 7 3.175,-3.073; 8 4.445,-3.073; 9 4.445,3.073; 10 3.175,3.073; 11 1.905,3.073; 12 0.635,3.073; 13 -0.635,3.073; 14 -1.905,3.073; 15 -3.175,3.073; 16 -4.445,3.073
TO252 = smd 1 x 1.6: 1 -2.28,-4.8; 2 2.28,-4.8 | smd 5.4 x 6.2: 3 0,2.5
DBZ_R-PDSO-G3 = smd 0.7 x 1: 1 -0.95,-1.1; 2 0.95,-1.1; 3 0,1.1
SO14 = smd 0.6 x 2.2: 1 -3.81,-2.6; 2 -2.54,-2.6; 3 -1.27,-2.6; 4 0,-2.6; 5 1.27,-2.6; 6 2.54,-2.6; 7 3.81,-2.6; 8 3.81,2.6; 9 2.54,2.6; 10 1.27,2.6; 11 0,2.6; 12 -1.27,2.6; 13 -2.54,2.6; 14 -3.81,2.6
SO08 = smd 0.6 x 2.2: 1 -1.905,-2.6; 2 -0.635,-2.6; 3 0.635,-2.6; 4 1.905,-2.6; 5 1.905,2.6; 6 0.635,2.6; 7 -0.635,2.6; 8 -1.905,2.6
SOP65P638X110-14N = smd 1.45 x 0.45: 1 -2.925,1.95; 2 -2.925,1.3; 3 -2.925,0.65; 4 -2.925,0; 5 -2.925,-0.65; 6 -2.925,-1.3; 7 -2.925,-1.95; 8 2.925,-1.95; 9 2.925,-1.3; 10 2.925,-0.65; 11 2.925,0; 12 2.925,0.65; 13 2.925,1.3; 14 2.925,1.95
1X05 = drill 1.016 pad 1.88: 1 0,0; 2 2.54,0; 3 5.08,0; 4 7.62,0; 5 10.16,0
1X02 = drill 1.016 pad 1.88: 1 0,0; 2 2.54,0
WQP_PJ_301M6 = drill 1.016 pad 1.778 octagon: P1 0,-5.715; P2 0,-3.175; P3 0,4.445 | hole 2.2: 0,0
2X08 = drill 1.016 octagon: 1 -8.89,-1.27; 2 -8.89,1.27; 3 -6.35,-1.27; 4 -6.35,1.27; 5 -3.81,-1.27; 6 -3.81,1.27; 7 -1.27,-1.27; 8 -1.27,1.27; 9 1.27,-1.27; 10 1.27,1.27; 11 3.81,-1.27; 12 3.81,1.27; 13 6.35,-1.27; 14 6.35,1.27; 15 8.89,-1.27; 16 8.89,1.27
1X03 = drill 1.016 long: 1 -2.54,0; 2 0,0; 3 2.54,0
1X02' = drill 1.016 long: 1 -1.27,0; 2 1.27,0
0603 = smd 0.85 x 0.7: 1 -0.9,0; 2 0.7,0
PTC-1206 = smd 1 x 1.8: 1 -1.4,0; 2 1.4,0
ALPS_POT_VERTICAL_PS = drill 1 pad 1.88 square: P$1 -2.5,7; P$2 0,7; P$3 2.5,7 | drill 1.5 pad 2.54 octagon: P$4 -4.7,0; P$5 4.7,0
SOT23-BEC = smd 1 x 1.4: B -0.95,-1.1; C 0,1.1; E 0.95,-1.1
R1206 = smd 1.6 x 1.803: 1 -1.422,0; 2 1.422,0
0204/5 = drill 0.813 octagon: 1 -2.54,0; 2 2.54,0
R0603 = smd 1 x 1.1: 1 -0.85,0; 2 0.85,0
PEC11R-4215F-S0024 = drill 1 square: 1 -2.5,7 | drill 1: 2 2.5,7; A -2.5,-7.5; B 2.5,-7.5; C 0,-7.5 | drill 1.8 long: P1 -5.7,0; P2 5.7,0
D6R = drill 1.1 pad 1.93: A1 -2.5,2.5; A2 2.5,2.5; B1 -2.5,-2.5; B2 2.5,-2.5
TENNSY41-E = drill 1: 0-RX1/CS1/CRX2 -27.94,-7.62; 1-TX1/MISO1/CTX2 -25.4,-7.62; 2-OUT2 -22.86,-7.62; 3-LRCLK2 -20.32,-7.62; 4-BCLK2 -17.78,-7.62; 5-IN2 -15.24,-7.62; 6-OUT1D -12.7,-7.62; 7-RX2/OUT1A -10.16,-7.62; 8-TX2/IN1 -7.62,-7.62; 9-OUT1C -5.08,-7.62; 10-CS\MQSR -2.54,-7.62; 11-MOSI/CTX1 0,-7.62; 12-MISO/MQSL 2.54,-7.62; 13-SCK/LED 2.54,7.62; 14-A0/TX3/SPDIF_OUT 0,7.62; 15-A1/RX3/SPDIF_IN -2.54,7.62; 16-A2/RX4/SCL1 -5.08,7.62; 17-A3/TX4/SDA1 -7.62,7.62; 18-A4/SDA0 -10.16,7.62; 19-A5/SCL0 -12.7,7.62; 20-A6/TX5/LRCLK1 -15.24,7.62; 21-A7/RX5/BCLK1 -17.78,7.62; 22-A8/CTX1 -20.32,7.62; 23-A9/CRX1/MCLK1 -22.86,7.62; 24-A10/TX6/SCL2 7.62,-7.62; 25-A11/RX6/SDA2 10.16,-7.62; 26-A12/MOSI1 12.7,-7.62; 27-A13/SCK1 15.24,-7.62; 28-RX7 17.78,-7.62; 29-TX7 20.32,-7.62; 30-CRX3 22.86,-7.62; 31-CTX3 25.4,-7.62; 32-OUT1B 27.94,-7.62; 33-MCLK2 27.94,7.62; 34-RX8 25.4,7.62; 35-TX8 22.86,7.62; 36-PWM 20.32,7.62; 37-PWM 17.78,7.62; 38-A14/CS/IN1 15.24,7.62; 39-A15/CS/OUT1A 12.7,7.62; 40-A16/CS1 10.16,7.62; 41-A17/MISO1 7.62,7.62; +5V -24.13,-4.62; DM -21.59,-4.62; DP -19.05,-4.62; GND4 -16.51,-4.62; GND5 -13.97,-4.62; ON/OFF 15.24,5.08; PROGRAM 15.24,2.54; VBAT 15.24,-5.08; VUSB -27.94,5.08 | drill 1 octagon: 3V3-1 5.08,-7.62; 3V3-2 15.24,-2.54; 3V3-3 -25.4,7.62 | drill 1 square: GND1 -30.48,-7.62; GND2 15.24,0; GND3 5.08,7.62; GND6 -27.94,7.62 | drill 1 pad 1.676: VIN -30.48,7.62
DISPLAY-OLED-128X64-I2C = drill 1 square: 1 -3.81,12.7 | drill 1: 2 -1.27,12.7; 3 1.27,12.7; 4 3.81,12.7 | hole 2: -10.414,11.557; 10.414,11.557; 10.414,-11.557; -10.414,-11.557
RK12L12C0A0G = drill 0.8 pad 1.3: A1 0,0; A2 2,0; A3 4,0; B1 -2,0; B2 -4,0; B3 6,0 | drill 2.9 pad 4.35: MH1 -4.5,11; MH2 6.5,11
F25D = smd 1.7 x 3.5: 1 -16.459,-6.045; 2 -13.716,-6.045; 3 -10.973,-6.045; 4 -8.23,-6.045; 5 -5.486,-6.045; 6 -2.743,-6.045; 7 0,-6.045; 8 2.743,-6.045; 9 5.486,-6.045; 10 8.23,-6.045; 11 10.973,-6.045; 12 13.716,-6.045; 13 16.459,-6.045 | smd 1.7 x 3.5 bottom: 14 -15.088,-6.045; 15 -12.344,-6.045; 16 -9.601,-6.045; 17 -6.858,-6.045; 18 -4.115,-6.045; 19 -1.372,-6.045; 20 1.372,-6.045; 21 4.115,-6.045; 22 6.858,-6.045; 23 9.601,-6.045; 24 12.344,-6.045; 25 15.088,-6.045
USB-A003 = smd 1.12 x 4: 1 -3.5,14; 2 -1,14; 3 1,14; 4 3.5,14 | hole 2.3: -6.57,10.28; 6.57,10.28

### Placement (x,y rotation side)
C1  124.46,3.81 180 bottom
C2  134.62,3.81 0 bottom
C3  24.13,38.1 270 bottom
C4  78.74,39.37 180 bottom
C11  15.24,22.86 270 bottom
C12  95.25,26.67 180 bottom
C13  27.94,67.31 0 top
C14  31.75,45.09 180 top
C15  81.28,63.5 180 top
C16  49.53,41.91 270 top
C20  116.84,58.42 270 bottom
C21  113.03,3.81 0 bottom
C101  127,43.18 90 top
C104  106.68,25.4 180 top
C106  77.47,73.66 0 top
C108  43.18,45.72 180 top
C110  127,38.1 90 top
C201  129.54,25.4 90 top
C204  129.54,30.48 90 top
C210  111.76,25.4 180 top
D1  118.11,19.05 0 bottom
D2  104.14,13.97 0 bottom
D3  132.08,19.05 180 bottom
IC1  78.74,83.82 0 bottom
IC2  83.82,30.48 270 bottom
IC3  15.24,72.39 0 bottom
IC4  129.54,27.94 90 bottom
IC6  77.47,69.85 90 bottom
IC7  125.73,55.88 180 bottom
IC8  43.18,41.91 90 bottom
IC9  54.61,83.82 0 bottom
IC10  127,40.64 270 bottom
J1  100.33,60.96 0 top
J2  100.33,58.42 0 top
J_BLUE  31.75,12.7 0 top
J_GREEN  19.05,12.7 0 top
J_RED  6.35,12.7 0 top
JP1  121.92,11.43 180 bottom
JP2  133.86,37.08 90 top
JP4  [1X02']  121.92,49.53 180 top
JP5  [1X02']  129.54,49.53 0 top
L3  76.2,34.29 0 bottom
MOD_A  6.35,35.56 0 top
MOD_B  19.05,35.56 0 top
P1  123.19,19.05 270 bottom
P2  106.68,10.16 180 bottom
P3  127,19.05 270 bottom
P_BLUE  73.66,55.88 180 top
P_GREEN  55.88,55.88 180 top
P_MODA  44.45,76.2 180 top
P_MODB  66.04,76.2 180 top
P_RED  36.83,55.88 180 top
P_SAMPLE  55.88,35.56 180 top
P_X  44.45,97.79 180 top
P_Y  66.04,97.79 180 top
Q1  19.05,25.4 0 bottom
Q2  6.35,25.4 0 bottom
Q3  33.02,24.13 0 bottom
R7  96.52,20.32 180 bottom
R8  24.13,82.55 180 top
R9  33.02,80.01 180 top
R10  24.13,80.01 180 top
R11  19.05,67.31 180 top
R12  24.13,43.18 270 bottom
R13  85.09,69.85 90 top
R14  19.05,64.77 180 top
R16  138.43,41.91 180 bottom
R18  139.7,33.02 0 top
R19  139.7,35.56 0 top
R20  139.7,38.1 0 top
R21  138.43,44.45 0 top
R22  96.52,59.69 0 bottom
R23  112.78,70.48 90 top
R24  138.43,46.99 180 bottom
R25  135.89,57.15 90 bottom
R26  102.87,19.05 180 bottom
R27  110.49,19.05 180 bottom
R28  119.38,34.29 0 bottom
R29  119.38,29.21 180 bottom
R30  119.38,24.13 180 bottom
R31  119.38,26.67 180 bottom
R32  127,34.29 180 bottom
R33  119.38,31.75 180 bottom
R35  138.43,49.53 180 bottom
R36  31.75,39.37 180 top
R37  31.75,41.91 0 top
R38  31.75,36.83 0 top
R39  31.75,34.29 180 top
R40  31.75,29.21 180 top
R41  31.75,31.75 0 top
R42  6.35,20.32 180 bottom
R43  11.43,26.67 180 bottom
R44  19.05,20.32 180 bottom
R45  25.4,26.67 180 bottom
R46  33.02,20.32 180 bottom
R47  25.4,24.13 0 bottom
SW7  129.54,95.25 0 top
SW_BLANK  73.66,12.7 0 top
SW_DOWN  104.14,36.83 0 top
SW_LEFT  93.98,44.45 0 top
SW_PLAY  55.88,12.7 0 top
SW_RECORD  91.44,12.7 0 top
SW_RIGHT  114.3,44.45 0 top
SW_UP  104.14,52.07 0 top
U1  110.49,25.4 0 bottom
U$2  119.38,72.39 180 bottom
U$3  104.14,93.98 0 top
VR1  12.7,87.63 0 top
X1  152.15,33.27 270 top
X2  153.67,88.9 270 bottom
X_IN  6.35,55.88 0 top
Y_IN  19.05,55.88 0 top

### Tracks (layer width: path | path; a pad name or v marks a point on that pad's centre or on a via)
3.3V  (7 unrouted)
!LDAC  (1 unrouted)
+3V3  (6 unrouted)
+3V3_A  (4 unrouted)
+5V  (12 unrouted)
+12V  (9 unrouted)
-12V  (8 unrouted)
AREF_3V3  (2 unrouted)
AREF_-10  (10 unrouted)
B1+1  (2 unrouted)
B+  (1 unrouted)
ENC_A  (1 unrouted)
ENC_B  (1 unrouted)
G1+  (2 unrouted)
G+  (1 unrouted)
GND  (28 unrouted)
  pour Top: 1.27,107.95 143.51,107.95 144.78,106.68 144.78,1.27 2.54,1.27 1.27,0
INH1  (1 unrouted)
INH2  (1 unrouted)
INTERLOCK  (1 unrouted)
INTERLOCK2  (1 unrouted)
MOD_A  (3 unrouted)
MOD_B  (3 unrouted)
MOSI  (1 unrouted)
MUXA  (2 unrouted)
MUXB  (2 unrouted)
MUXC  (2 unrouted)
MUXOUT1  (1 unrouted)
MUXOUT2  (1 unrouted)
N$1  (1 unrouted)
N$3  (1 unrouted)
N$4  (1 unrouted)
N$5  (1 unrouted)
N$6  (4 unrouted)
N$7  (2 unrouted)
N$8  (2 unrouted)
N$9  (1 unrouted)
N$10  (2 unrouted)
N$11  (4 unrouted)
N$12  (1 unrouted)
N$13  (1 unrouted)
N$14  (4 unrouted)
N$15  (1 unrouted)
N$16  (2 unrouted)
N$17  (1 unrouted)
N$19  (1 unrouted)
N$20  (1 unrouted)
N$21  (1 unrouted)
N$22  (1 unrouted)
N$23  (1 unrouted)
N$24  (1 unrouted)
N$25  (1 unrouted)
N$26  (1 unrouted)
N$27  (1 unrouted)
N$28  (1 unrouted)
N$29  (1 unrouted)
N$30  (2 unrouted)
N$31  (2 unrouted)
N$32  (1 unrouted)
N$33  (1 unrouted)
N$34  (4 unrouted)
N$35  (2 unrouted)
N$36  (2 unrouted)
N$39  (1 unrouted)
N$40  (1 unrouted)
N$41  (1 unrouted)
N$42  (1 unrouted)
N$43  (1 unrouted)
N$44  (1 unrouted)
N$45  (1 unrouted)
N$46  (1 unrouted)
N$48  (1 unrouted)
N$49  (1 unrouted)
N$51  (1 unrouted)
N$52  (1 unrouted)
N$66  (1 unrouted)
OUTL  (2 unrouted)
OUTR  (2 unrouted)
R1+  (2 unrouted)
R+  (1 unrouted)
SCK  (1 unrouted)
SCL  (1 unrouted)
SDA  (1 unrouted)
SHUTTER  (1 unrouted)
SS  (1 unrouted)
T26  (2 unrouted)
T27  (2 unrouted)
T38  (2 unrouted)
TB  (2 unrouted)
TG  (2 unrouted)
TR  (2 unrouted)
X1+  (2 unrouted)
X1-  (2 unrouted)
X2  (3 unrouted)
X+  (1 unrouted)
X-  (1 unrouted)
X_IN  (3 unrouted)
Y1+  (2 unrouted)
Y1-  (2 unrouted)
Y2  (3 unrouted)
Y+  (1 unrouted)
Y-  (1 unrouted)
Y_IN  (3 unrouted)

### Text on the board
TallParts: ISP
ArduinoHoles: 3.2mm | 2.2mm | 3.2mm